# Altium schematic sheet IR_robottino_emcoders.SchDoc
size A4
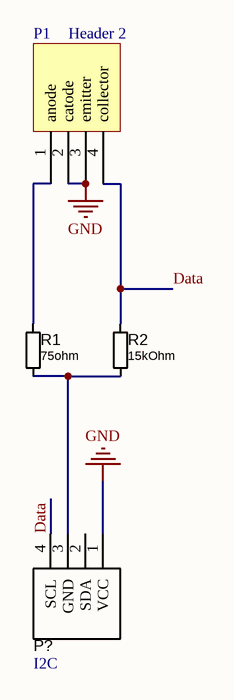
[diagram p0: IR_robottino_emcoders.SchDoc]

## Parts
P1  Header 2  [TCRT 1000]
P?  I2C  [TYCO/215079-4]
R1  75ohm  [R/1206]
R2  15kOhm  [R/0805]

## Nets
GND: P1.2(catode) P1.3(emitter) P?.1(VCC)
Data: P1.4(collector) P?.4(SCL) R2.2
NetP1_1: P1.1(anode) R1.2
NetP?_3: P?.3(GND) R1.1 R2.1

Not connected (* = marked no-connect by the designer): P? 2(SDA)

## Library data of the parts
P1 = TCRT 1000: Header, 2-Pin; LatestRevisionDate: 17-Jul-2002; LatestRevisionNote: Re-released for DXP Platform.; Publisher: Altium Limited
P? = Micromatch-I2C: Micromatch I2C Connector
R1 R2 = R: Resistor; Published: 8-Jun-2000; LatestRevisionDate: 17-Jul-2002; LatestRevisionNote: Re-released for DXP Platform.; PackageReference: AXIAL-0.4; Publisher: Altium Limited
  R1: Value: 75ohm
  R2: Value: 15kOhm